# Altium project RAD.PrjPcb
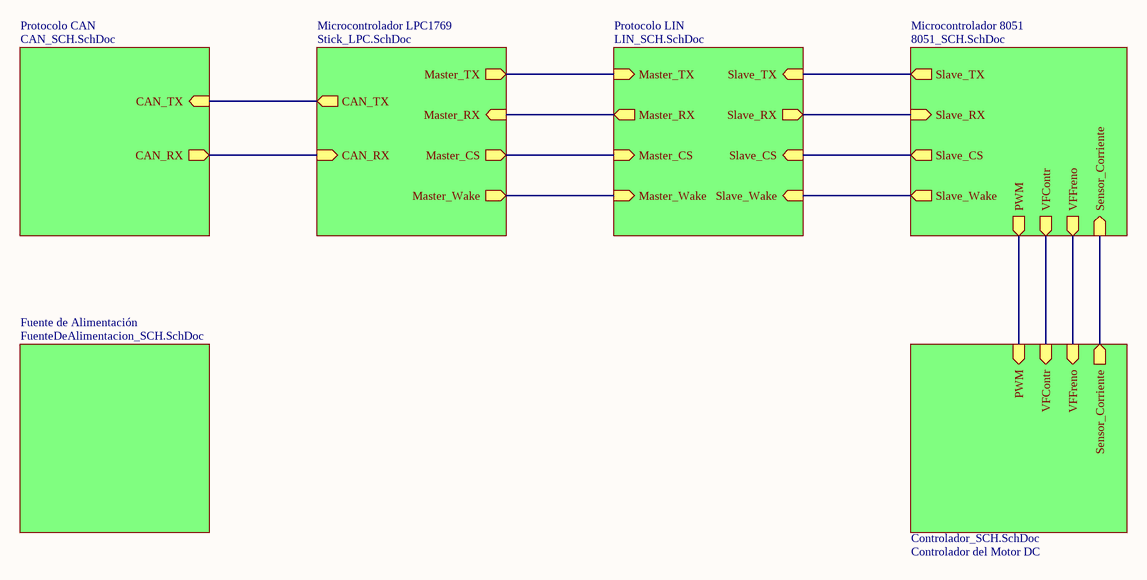
[diagram p0: TOP_SCH.SchDoc]
7 sheets, 87 parts. Net scope: hierarchical (ports join the sheet entries above them; power ports are global).
Board file: PCB_RAD.PcbDoc
Sheets:
  TOP_SCH.SchDoc
    Protocolo CAN = CAN_SCH.SchDoc
    Microcontrolador LPC1769 = Stick_LPC.SchDoc
    Protocolo LIN = LIN_SCH.SchDoc
    Microcontrolador 8051 = 8051_SCH.SchDoc
    Controlador del Motor DC = Controlador_SCH.SchDoc
    Fuente de Alimentación = FuenteDeAlimentacion_SCH.SchDoc

## Sheet TOP_SCH.SchDoc: Top Connections
size A4; Author: **; CompanyName: Electrónica Aplicada al Automotor; Organization: UTN FRBA; DocumentNumber: 1; Revision: 00; SheetNumber: 1; SheetTotal: 7; Autor: Badenas, Francisco J. / Ipar, Eugenia

### Sub-sheets
Controlador del Motor DC = Controlador_SCH.SchDoc: Sensor_Corriente (out), VFFreno (in), VFContr (in), PWM (in)
Fuente de Alimentación = FuenteDeAlimentacion_SCH.SchDoc: no entries
Microcontrolador 8051 = 8051_SCH.SchDoc: Slave_TX (out), Slave_RX (in), Slave_CS (out), Slave_Wake (out), PWM (out), VFContr (out), VFFreno (out), Sensor_Corriente (in)
Microcontrolador LPC1769 = Stick_LPC.SchDoc: CAN_TX (out), CAN_RX (in), Master_TX (out), Master_RX (in), Master_CS (out), Master_Wake (out)
Protocolo CAN = CAN_SCH.SchDoc: CAN_TX (in), CAN_RX (out)
Protocolo LIN = LIN_SCH.SchDoc: Master_TX (in), Master_RX (out), Master_CS (in), Master_Wake (in), Slave_TX (in), Slave_RX (out), Slave_CS (in), Slave_Wake (in)

### Nets
LPC_CAN_RX: sheet Protocolo CAN/CAN_RX, sheet Microcontrolador LPC1769/CAN_RX
LPC_CAN_TX: sheet Protocolo CAN/CAN_TX, sheet Microcontrolador LPC1769/CAN_TX
LPC_CS: sheet Microcontrolador LPC1769/Master_CS, sheet Protocolo LIN/Master_CS
LPC_RX: sheet Microcontrolador LPC1769/Master_RX, sheet Protocolo LIN/Master_RX
LPC_TX: sheet Microcontrolador LPC1769/Master_TX, sheet Protocolo LIN/Master_TX
LPC_W: sheet Microcontrolador LPC1769/Master_Wake, sheet Protocolo LIN/Master_Wake
PWM: sheet Microcontrolador 8051/PWM, sheet Controlador del Motor DC/PWM
Slave_CS: sheet Protocolo LIN/Slave_CS, sheet Microcontrolador 8051/Slave_CS
Slave_RX: sheet Protocolo LIN/Slave_RX, sheet Microcontrolador 8051/Slave_RX
Slave_TX: sheet Protocolo LIN/Slave_TX, sheet Microcontrolador 8051/Slave_TX
Slave_Wake: sheet Protocolo LIN/Slave_Wake, sheet Microcontrolador 8051/Slave_Wake
VFContr: sheet Microcontrolador 8051/VFContr, sheet Controlador del Motor DC/VFContr
VFFreno: sheet Microcontrolador 8051/VFFreno, sheet Controlador del Motor DC/VFFreno
NetC3_1: sheet Microcontrolador 8051/Sensor_Corriente, sheet Controlador del Motor DC/Sensor_Corriente

### Notes on the sheet
- Title:
- Size:
- Author:
- A4
- Sheet
- of
- Revision:
- File:
- Date:

## Sheet CAN_SCH.SchDoc: Transceiver CAN
size A4; Author: **; CompanyName: Electrónica Aplicada al Automotor; Organization: UTN FRBA; DocumentNumber: 6; Revision: 00; SheetNumber: 6; SheetTotal: 7; Autor: Badenas, Francisco J. / Ipar, Eugenia
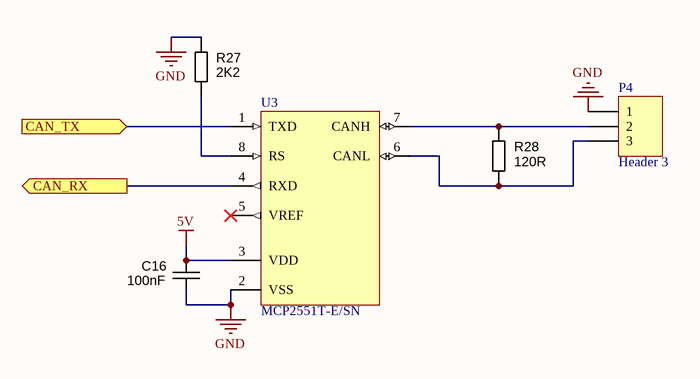
[diagram p1: CAN_SCH.SchDoc]

### Parts
C16  100nF  [CAPC1608X90N]
P4  Header 3  [HDR1X3]
R27  2K2  [RESC1608N_ZERO]
R28  120R  [RESC1608N_ZERO]
U3  MCP2551T-E/SN  [SOIC-SN8_M]

### Ports
CAN_RX (out), CAN_TX (in)

### Nets
5V: C16.1 U3.3(VDD)
GND: C16.2 P4.1 R27.1 U3.2(VSS)
LPC_CAN_RX: U3.4(RXD) ; port CAN_RX
LPC_CAN_TX: U3.1(TXD) ; port CAN_TX
NetP4_2: P4.2 R28.1 U3.7(CANH)
NetP4_3: P4.3 R28.2 U3.6(CANL)
NetR27_2: R27.2 U3.8(RS)

Not connected (* = marked no-connect by the designer): U3 5(VREF)*

### Notes on the sheet
- Title:
- Size:
- Author:
- A4
- Sheet
- of
- Revision:
- File:
- Date:

### Library data of the parts
C16 = CAPC_47n_0603_X7R_50V_10%: Capacitor SMD Cer 100nF 10% 50V X7R 0603; Manufacturer 1: AVX Corporation; Manufacturer Part Number 1: 06035C473KAT2A; Ratings: 50V; X7R; Material: ceramic; SCDType: spec; Manufacturer 3: Samsung; Manufacturer Part Number 3: CL10B473KBN; Package / Case: 0603 (1608 metric); Tolerance: ±10%; Supplier 1: Digi-Key; Supplier Part Number 1: 478-5146-1-ND; Manufacturer Part Number 2: C1608X7R1H473K080AA; Manufacturer 2: TDK Corporation; ComponentLink1URL: http://www.avx.com/docs/Catalogs/cx7r.pdf; ComponentLink1Description: http://www.avx.com/docs/Catalogs/cx7r.pdf; Supplier 2: Digi-Key; Supplier Part Number 2: 445-1313-1-ND; ComponentLink2URL: http://product.tdk.com/capacitor/mlcc/en/documents/mlcc_commercial_general_en.pdf; ComponentLink2Description: http://product.tdk.com/capacitor/mlcc/en/documents/mlcc_commercial_general_en.pdf; Value: 100nF
P4 = Header 3: Header, 3-Pin; LatestRevisionDate: 17-Jul-2002; LatestRevisionNote: Re-released for DXP Platform.; Publisher: Altium Limited
R27 = RES_0R_0603: Resistor SMD 0603 2.2K 5%; Manufacturer 1: Vishay/Dale; Manufacturer Part Number 1: CRCW06030000Z0EA; Ratings: 1/10W; SCDType: spec; Tolerance: ±5%; Package / Case: 0603 (1608metric); Supplier 1: Digi-Key; Supplier Part Number 1: 541-0.0GCT-ND; ComponentLink1URL: http://www.vishay.com/doc?20035; ComponentLink1Description: http://www.vishay.com/doc?20035; Supplier 2: Digi-Key; Supplier Part Number 2: P0.0GTR-ND; Manufacturer 2: Panasonic Electronic Components; Manufacturer Part Number 2: ERJ-3GEY0R00V; RoHS 2: RoHS Compliant; ComponentLink2URL: http://industrial.panasonic.com/www-cgi/jvcr13pz.cgi?E+PZ+3+AOA0001+ERJ3GEY0R00V+7+WW; ComponentLink2Description: http://industrial.panasonic.com/www-cgi/jvcr13pz.cgi?E+PZ+3+AOA0001+ERJ3GEY0R00V+7+WW; Supplier 3: Digi-Key; Supplier Part Number 3: 311-0.0LECT-ND; Manufacturer 3: Yageo; Manufacturer Part Number 3: AC0603JR-070RL; RoHS 3: RoHS Compliant; ComponentLink3URL: http://www.yageo.com/documents/recent/PYu-AC_51_RoHS_L_2.pdf; ComponentLink3Description: http://www.yageo.com/documents/recent/PYu-AC_51_RoHS_L_2.pdf; Value: 2K2
R28 = RES_0R_0603: Resistor SMD 0603 120 Ohm 5%; Manufacturer 1: Vishay/Dale; Manufacturer Part Number 1: CRCW06030000Z0EA; Ratings: 1/10W; SCDType: spec; Tolerance: ±5%; Package / Case: 0603 (1608metric); Supplier 1: Digi-Key; Supplier Part Number 1: 541-0.0GCT-ND; ComponentLink1URL: http://www.vishay.com/doc?20035; ComponentLink1Description: http://www.vishay.com/doc?20035; Supplier 2: Digi-Key; Supplier Part Number 2: P0.0GTR-ND; Manufacturer 2: Panasonic Electronic Components; Manufacturer Part Number 2: ERJ-3GEY0R00V; RoHS 2: RoHS Compliant; ComponentLink2URL: http://industrial.panasonic.com/www-cgi/jvcr13pz.cgi?E+PZ+3+AOA0001+ERJ3GEY0R00V+7+WW; ComponentLink2Description: http://industrial.panasonic.com/www-cgi/jvcr13pz.cgi?E+PZ+3+AOA0001+ERJ3GEY0R00V+7+WW; Supplier 3: Digi-Key; Supplier Part Number 3: 311-0.0LECT-ND; Manufacturer 3: Yageo; Manufacturer Part Number 3: AC0603JR-070RL; RoHS 3: RoHS Compliant; ComponentLink3URL: http://www.yageo.com/documents/recent/PYu-AC_51_RoHS_L_2.pdf; ComponentLink3Description: http://www.yageo.com/documents/recent/PYu-AC_51_RoHS_L_2.pdf; Value: 120R
U3 = CMP-0186-00036-2: High-Speed CAN Transceiver, 8-Pin SOIC, Extended Temperature, Tape and Reel; PackageReference: SOIC-SN8; PackageDescription: 8-Lead Plastic Small Outline (SN) - Narrow, 3.90mm Body [SOIC]; RevisionNote: URLs added. DatasheetVersion updated.; ComponentLink2Description: Datasheet; ComponentLink1Description: Manufacturer URL; ComponentLink3Description: Package Specification; PackageVersion: revBB, Aug-2009; DatasheetVersion: revF, Jul-2010; Code_JEDEC: MS-012; ComponentLink1URL: http://www.microchip.com/; Code_IPC: SOIC127P600-8; ComponentLink2URL: http://ww1.microchip.com/downloads/en/DeviceDoc/21667F.pdf; ComponentLink3URL: http://www.microchip.com/stellent/groups/techpub_sg/documents/packagingspec/en012702.pdf

## Sheet Stick_LPC.SchDoc: Microcontrolador LPC1769
size A4; Author: **; CompanyName: Electrónica Aplicada al Automotor; Organization: UTN FRBA; DocumentNumber: 3; Revision: 00; SheetNumber: 3; SheetTotal: 7; Autor: Badenas, Francisco J. / Ipar, Eugenia
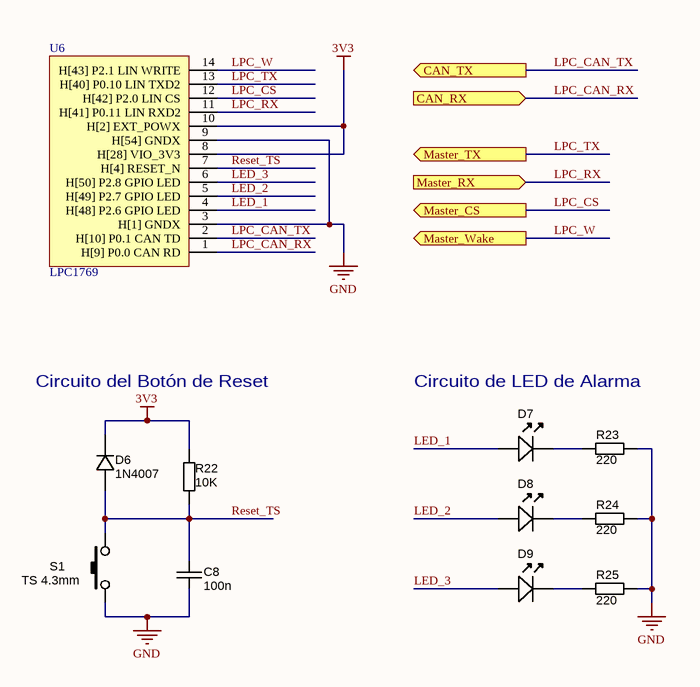
[diagram p2: Stick_LPC.SchDoc]

### Parts
C8  100n  [CAPC1608X90N]
D6  1N4007  [DO-214AC]
D7  Green  [LED-0603-GREEN]  (value not drawn)
D8  Green  [LED-0603-GREEN]  (value not drawn)
D9  Green  [LED-0603-GREEN]  (value not drawn)
R22  10K  [RESC1608N_ZERO]
R23  220  [RESC1608N_ZERO]
R24  220  [RESC1608N_ZERO]
R25  220  [RESC1608N_ZERO]
S1  Manufacturer Part Number 1: TS 4.3mm  [TACT-SWITCH-TS1143]  (hidden comment: SW_THT_PB_4.3mm)
U6  LPC1769  [Header_12]

### Ports
CAN_RX (in), CAN_TX (out), Master_CS (out), Master_RX (in), Master_TX (out), Master_Wake (out)

### Nets
3V3: D6.K R22.1 U6.8(H[28]_VIO_3V3) U6.10(H[2]_EXT_POWX)
GND: C8.2 R23.2 R24.2 R25.2 S1.1 U6.3(H[1]_GNDX) U6.9(H[54]_GNDX)
LED_1: D7.A U6.4(H[48]_P2.6_GPIO_LED)
LED_2: D8.A U6.5(H[49]_P2.7_GPIO_LED)
LED_3: D9.A U6.6(H[50]_P2.8_GPIO_LED)
LPC_CAN_RX: U6.1(H[9]_P0.0_CAN_RD) ; port CAN_RX
LPC_CAN_TX: U6.2(H[10]_P0.1_CAN_TD) ; port CAN_TX
LPC_CS: U6.12(H[42]_P2.0_LIN_CS) ; port Master_CS
LPC_RX: U6.11(H[41]_P0.11_LIN_RXD2) ; port Master_RX
LPC_TX: U6.13(H[40]_P0.10_LIN_TXD2) ; port Master_TX
LPC_W: U6.14(H[43]_P2.1_LIN_WRITE) ; port Master_Wake
Reset_TS: C8.1 D6.A R22.2 S1.2 U6.7(H[4]_RESET_N)
NetD7_K: D7.K R23.1
NetD8_K: D8.K R24.1
NetD9_K: D9.K R25.1

### Notes on the sheet
- Circuito del Botón de Reset
- Circuito de LED de Alarma
- Title:
- Size:
- Author:
- A4
- Sheet
- of
- Revision:
- File:
- Date:

### Library data of the parts
C8 = CAPC_47n_0603_X7R_50V_10%: as C16 on sheet CAN_SCH; Manufacturer 3: Samsung; Manufacturer Part Number 3: CL10B473KBN; Package / Case: 0603 (1608 metric); Tolerance: ±10%; Supplier 1: Digi-Key; Supplier Part Number 1: 478-5146-1-ND; Manufacturer Part Number 2: C1608X7R1H473K080AA; Manufacturer 2: TDK Corporation; ComponentLink1URL: http://www.avx.com/docs/Catalogs/cx7r.pdf; ComponentLink1Description: http://www.avx.com/docs/Catalogs/cx7r.pdf; Supplier 2: Digi-Key; Supplier Part Number 2: 445-1313-1-ND; ComponentLink2URL: http://product.tdk.com/capacitor/mlcc/en/documents/mlcc_commercial_general_en.pdf; ComponentLink2Description: http://product.tdk.com/capacitor/mlcc/en/documents/mlcc_commercial_general_en.pdf; Value: 100n
D6 = DIODE_100V_1.5A_SMA: Diode 1N4007 SMD DO-214AC 100V 1.5A SMA; Manufacturer 1: Diodes Inc; Ratings: 100V; 1.5A; Material: Si; Diode Type: Standard; Value: Vf = 1.15V @ 1.5A (Max); SCDType: source; Package / Case: DO-214AC, SMA; Supplier 1: Digi-Key; Supplier Part Number 1: S2BA-FDICT-ND; Manufacturer Part Number 1: 1N4007
D7-D9 = LED_SMD_Green_0603_570nm: LED 0603 SMD Green 570nm 50mcd 20mA; Manufacturer 1: Kingbright Company LLC; Manufacturer Part Number 1: APT1608CGCK; Material: AlGaInP; Ratings: 20mcd min; 50 mcd typ; 570 nm; Voltage - Forward (Vf) Typ: 2.1V; Viewing Angle: 120°; Lens Style/Size: Rectangle with Flat Top, 1.1mm x 0.8mm; Voltage - Forward (Vf) @ 10mA: 2.0V; SCDType: source; Wavelength - Peak: 574nm; Lens Type: Clear; Package / Case: 0603 (1608 metric); Color: Green; Current - Test: 20mA; Supplier 1: Digi-Key; Supplier Part Number 1: 754-1116-1-ND; RoHS 1: RoHS Compliant; Wavelength - Dominant: 570nm; ComponentLink1URL: http://www.us.kingbright.com/images/catalog/SPEC/APT1608CGCK.pdf; ComponentLink1Description: http://www.us.kingbright.com/images/catalog/SPEC/APT1608CGCK.pdf
R22 = RES_0R_0603: Resistor SMD 0603 10K 5%; Manufacturer 1: Vishay/Dale; Manufacturer Part Number 1: CRCW06030000Z0EA; Ratings: 1/10W; SCDType: spec; Tolerance: ±5%; Package / Case: 0603 (1608metric); Supplier 1: Digi-Key; Supplier Part Number 1: 541-0.0GCT-ND; ComponentLink1URL: http://www.vishay.com/doc?20035; ComponentLink1Description: http://www.vishay.com/doc?20035; Supplier 2: Digi-Key; Supplier Part Number 2: P0.0GTR-ND; Manufacturer 2: Panasonic Electronic Components; Manufacturer Part Number 2: ERJ-3GEY0R00V; RoHS 2: RoHS Compliant; ComponentLink2URL: http://industrial.panasonic.com/www-cgi/jvcr13pz.cgi?E+PZ+3+AOA0001+ERJ3GEY0R00V+7+WW; ComponentLink2Description: http://industrial.panasonic.com/www-cgi/jvcr13pz.cgi?E+PZ+3+AOA0001+ERJ3GEY0R00V+7+WW; Supplier 3: Digi-Key; Supplier Part Number 3: 311-0.0LECT-ND; Manufacturer 3: Yageo; Manufacturer Part Number 3: AC0603JR-070RL; RoHS 3: RoHS Compliant; ComponentLink3URL: http://www.yageo.com/documents/recent/PYu-AC_51_RoHS_L_2.pdf; ComponentLink3Description: http://www.yageo.com/documents/recent/PYu-AC_51_RoHS_L_2.pdf; Value: 10K
R23-R25 = RES_0R_0603: Resistor SMD 0603 220 Ohm 5%; Manufacturer 1: Vishay/Dale; Manufacturer Part Number 1: CRCW06030000Z0EA; Ratings: 1/10W; SCDType: spec; Tolerance: ±5%; Package / Case: 0603 (1608metric); Supplier 1: Digi-Key; Supplier Part Number 1: 541-0.0GCT-ND; ComponentLink1URL: http://www.vishay.com/doc?20035; ComponentLink1Description: http://www.vishay.com/doc?20035; Supplier 2: Digi-Key; Supplier Part Number 2: P0.0GTR-ND; Manufacturer 2: Panasonic Electronic Components; Manufacturer Part Number 2: ERJ-3GEY0R00V; RoHS 2: RoHS Compliant; ComponentLink2URL: http://industrial.panasonic.com/www-cgi/jvcr13pz.cgi?E+PZ+3+AOA0001+ERJ3GEY0R00V+7+WW; ComponentLink2Description: http://industrial.panasonic.com/www-cgi/jvcr13pz.cgi?E+PZ+3+AOA0001+ERJ3GEY0R00V+7+WW; Supplier 3: Digi-Key; Supplier Part Number 3: 311-0.0LECT-ND; Manufacturer 3: Yageo; Manufacturer Part Number 3: AC0603JR-070RL; RoHS 3: RoHS Compliant; ComponentLink3URL: http://www.yageo.com/documents/recent/PYu-AC_51_RoHS_L_2.pdf; ComponentLink3Description: http://www.yageo.com/documents/recent/PYu-AC_51_RoHS_L_2.pdf; Value: 220
S1 = SW_THT_PB_4.3mm: Switch, tact, 4.3mm stem; Manufacturer 1: Bond-Tact; Function: Speed; SCDType: spec; Package / Case: 6.5x6.5mm; 4.3mm stem; Material: Brass/Nylon/Ag plating
U6 = LPC1769_Pinera: LPC1769 Pinera 5mm

## Sheet LIN_SCH.SchDoc: Transceiver LIN
size A4; Author: **; CompanyName: Electrónica Aplicada al Automotor; Organization: UTN FRBA; DocumentNumber: 7; Revision: 00; SheetNumber: 7; SheetTotal: 7; Autor: Badenas, Francisco J. / Ipar, Eugenia
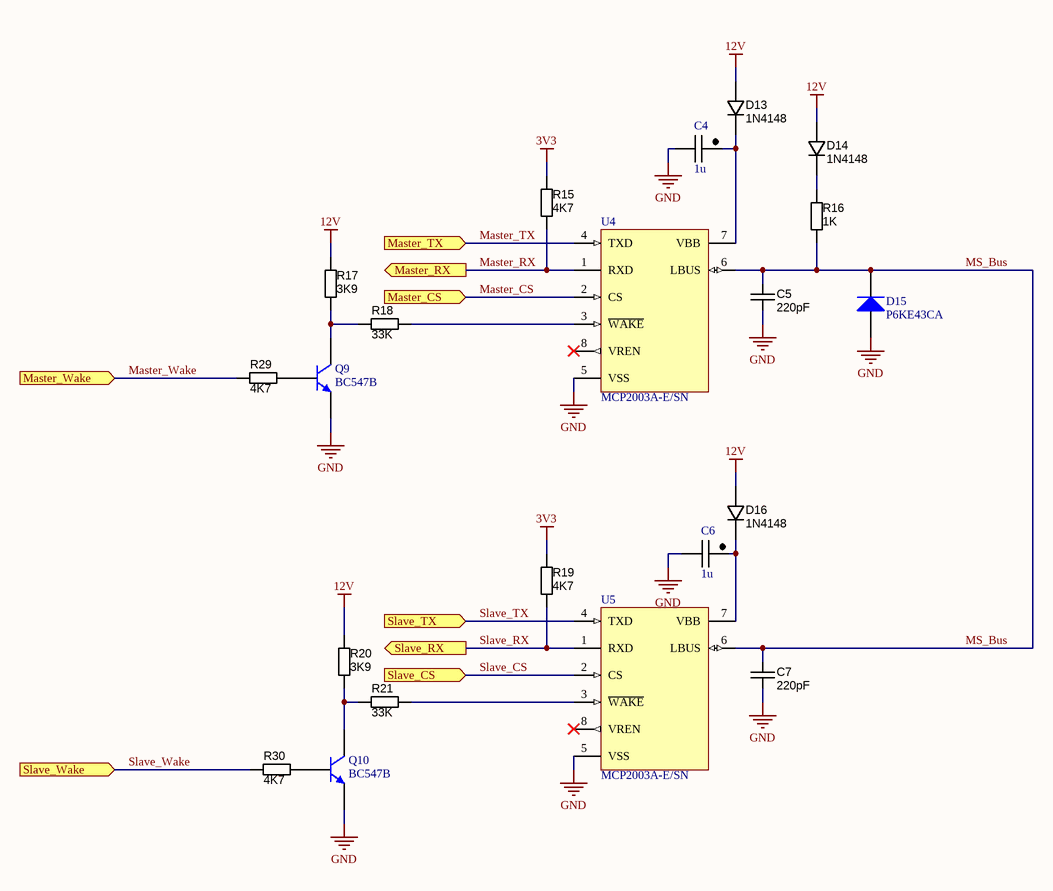
[diagram p3: LIN_SCH.SchDoc]

### Parts
C4  1u  [CAP_Elec_5x5.7]
C5  220pF  [CAPC1608X90N]
C6  1u  [CAP_Elec_5x5.7]
C7  220pF  [CAPC1608X90N]
D13  1N4148  [SOD523F]
D14  1N4148  [SOD523F]
D15  P6KE43CA  [DO-41]
D16  1N4148  [SOD523F]
Q9  BC547B  [TO-92A]
Q10  BC547B  [TO-92A]
R15  4K7  [RESC1608N_ZERO]
R16  1K  [RESC1608N_ZERO]
R17  3K9  [RESC1608N_ZERO]
R18  33K  [RESC1608N_ZERO]
R19  4K7  [RESC1608N_ZERO]
R20  3K9  [RESC1608N_ZERO]
R21  33K  [RESC1608N_ZERO]
R29  4K7  [RESC1608N_ZERO]
R30  4K7  [RESC1608N_ZERO]
U4  MCP2003A-E/SN  [SOIC-SN8_N]
U5  MCP2003A-E/SN  [SOIC-SN8_N]

### Ports
Master_CS (in), Master_RX (out), Master_TX (in), Master_Wake (in), Slave_CS (in), Slave_RX (out), Slave_TX (in), Slave_Wake (in)

### Nets
3V3: R15.1 R19.1
12V: D13.A D14.A D16.A R17.1 R20.1
GND: C4.2 C5.2 C6.2 C7.2 D15.1(A) Q9.1(E) Q10.1(E) U4.5(VSS) U5.5(VSS)
Master_CS: U4.2(CS) ; port Master_CS  [project net LPC_CS]
Master_RX: R15.2 U4.1(RXD) ; port Master_RX  [project net LPC_RX]
Master_TX: U4.4(TXD) ; port Master_TX  [project net LPC_TX]
Master_Wake: R29.1 ; port Master_Wake  [project net LPC_W]
MS_Bus: C5.1 C7.1 D15.2(K) R16.2 U4.6(LBUS) U5.6(LBUS)
Slave_CS: U5.2(CS) ; port Slave_CS
Slave_RX: R19.2 U5.1(RXD) ; port Slave_RX
Slave_TX: U5.4(TXD) ; port Slave_TX
Slave_Wake: R30.1 ; port Slave_Wake
NetC4_1: C4.1 D13.K U4.7(VBB)
NetC6_1: C6.1 D16.K U5.7(VBB)
NetD14_K: D14.K R16.1
NetQ9_2: Q9.2(B) R29.2
NetQ9_3: Q9.3(C) R17.2 R18.1
NetQ10_2: Q10.2(B) R30.2
NetQ10_3: Q10.3(C) R20.2 R21.1
NetR18_2: R18.2 U4.3(~{WAKE})
NetR21_2: R21.2 U5.3(~{WAKE})

Not connected (* = marked no-connect by the designer): U4 8(VREN)*; U5 8(VREN)*

### Notes on the sheet
- Title:
- Size:
- Author:
- A4
- Sheet
- of
- Revision:
- File:
- Date:

### Library data of the parts
C4 C6 = CAP_Elec_4x4
C5 C7 = CAPC_47n_0603_X7R_50V_10%: Capacitor SMD Cer 220pF 10% 50V X7R 0603; Manufacturer 1: AVX Corporation; Manufacturer Part Number 1: 06035C473KAT2A; Ratings: 50V; X7R; Material: ceramic; SCDType: spec; Manufacturer 3: Samsung; Manufacturer Part Number 3: CL10B473KBN; Package / Case: 0603 (1608 metric); Tolerance: ±10%; Supplier 1: Digi-Key; Supplier Part Number 1: 478-5146-1-ND; Manufacturer Part Number 2: C1608X7R1H473K080AA; Manufacturer 2: TDK Corporation; ComponentLink1URL: http://www.avx.com/docs/Catalogs/cx7r.pdf; ComponentLink1Description: http://www.avx.com/docs/Catalogs/cx7r.pdf; Supplier 2: Digi-Key; Supplier Part Number 2: 445-1313-1-ND; ComponentLink2URL: http://product.tdk.com/capacitor/mlcc/en/documents/mlcc_commercial_general_en.pdf; ComponentLink2Description: http://product.tdk.com/capacitor/mlcc/en/documents/mlcc_commercial_general_en.pdf; Value: 220pF
D13 D14 D16 = DIODE_1N4148_200mA_SOD523F: Diode 1N4148 SMD SOD-523F; Manufacturer 1: Fairchild Semiconductor; Manufacturer Part Number 1: 1N4148WT; Ratings: Vr=75V; Vf=1V@10mA; Io=200mA; Material: Si; SCDType: source; Package / Case: SC-79, SOD-523F; Supplier 1: Digi-Key; Supplier Part Number 1: 1N4148WTCT-ND; ComponentLink1URL: http://www.fairchildsemi.com/ds/1N/1N914BWT.pdf; ComponentLink1Description: http://www.fairchildsemi.com/ds/1N/1N914BWT.pdf; Value: 1N4148
D15 = Diode 1N4007: 1 Amp General Purpose Rectifier Do-41; Published: 8-Jun-2000; LatestRevisionDate: 17-Jul-2002; LatestRevisionNote: Re-released for DXP Platform.; DatasheetVersion: 1998; PackageVersion: Aug-1999; PackageReference: DO-41; Publisher: Altium Limited; PackageDescription: Diode, Axial; Body 5.2 x 2.7 mm (LxDia. max), Lead Dia. 0.86 mm (max); Code_JEDEC: DO-204-AL; ComponentLink1Description: Manufacturer Link; ComponentLink1URL: http://www.fairchildsemi.com/; ComponentLink2Description: Datasheet; ComponentLink2URL: http://www.fairchildsemi.com/ds/1N%2F1N4001.pdf
Q9 Q10 = 2N3904: NPN General Purpose Amplifier; Published: 8-Jun-2000; LatestRevisionDate: 15-Jan-2003; LatestRevisionNote: PCB Footprint 'BCY-W3/D4.7' replaced; DatasheetVersion: 1997; PackageVersion: Sep-1998; PackageReference: TO-92A; Publisher: Altium Limited; PackageDescription: TO, Flat Index; 3 In-Line, Axial Leads; Body Dia. 4.5mm; Leads 0.51 x 0.48 mm (max); ComponentLink1Description: Manufacturer Link; ComponentLink1URL: http://www.fairchildsemi.com/; ComponentLink2Description: Datasheet; ComponentLink2URL: http://www.fairchildsemi.com/ds/2N%2F2N3904.pdf
R15 R19 R29 R30 = RES_0R_0603: Resistor SMD 0603 4.7K 5%; Manufacturer 1: Vishay/Dale; Manufacturer Part Number 1: CRCW06030000Z0EA; Ratings: 1/10W; SCDType: spec; Tolerance: ±5%; Package / Case: 0603 (1608metric); Supplier 1: Digi-Key; Supplier Part Number 1: 541-0.0GCT-ND; ComponentLink1URL: http://www.vishay.com/doc?20035; ComponentLink1Description: http://www.vishay.com/doc?20035; Supplier 2: Digi-Key; Supplier Part Number 2: P0.0GTR-ND; Manufacturer 2: Panasonic Electronic Components; Manufacturer Part Number 2: ERJ-3GEY0R00V; RoHS 2: RoHS Compliant; ComponentLink2URL: http://industrial.panasonic.com/www-cgi/jvcr13pz.cgi?E+PZ+3+AOA0001+ERJ3GEY0R00V+7+WW; ComponentLink2Description: http://industrial.panasonic.com/www-cgi/jvcr13pz.cgi?E+PZ+3+AOA0001+ERJ3GEY0R00V+7+WW; Supplier 3: Digi-Key; Supplier Part Number 3: 311-0.0LECT-ND; Manufacturer 3: Yageo; Manufacturer Part Number 3: AC0603JR-070RL; RoHS 3: RoHS Compliant; ComponentLink3URL: http://www.yageo.com/documents/recent/PYu-AC_51_RoHS_L_2.pdf; ComponentLink3Description: http://www.yageo.com/documents/recent/PYu-AC_51_RoHS_L_2.pdf; Value: 4K7
R16 = RES_0R_0603: Resistor SMD 0603 1K 5%; Manufacturer 1: Vishay/Dale; Manufacturer Part Number 1: CRCW06030000Z0EA; Ratings: 1/10W; SCDType: spec; Tolerance: ±5%; Package / Case: 0603 (1608metric); Supplier 1: Digi-Key; Supplier Part Number 1: 541-0.0GCT-ND; ComponentLink1URL: http://www.vishay.com/doc?20035; ComponentLink1Description: http://www.vishay.com/doc?20035; Supplier 2: Digi-Key; Supplier Part Number 2: P0.0GTR-ND; Manufacturer 2: Panasonic Electronic Components; Manufacturer Part Number 2: ERJ-3GEY0R00V; RoHS 2: RoHS Compliant; ComponentLink2URL: http://industrial.panasonic.com/www-cgi/jvcr13pz.cgi?E+PZ+3+AOA0001+ERJ3GEY0R00V+7+WW; ComponentLink2Description: http://industrial.panasonic.com/www-cgi/jvcr13pz.cgi?E+PZ+3+AOA0001+ERJ3GEY0R00V+7+WW; Supplier 3: Digi-Key; Supplier Part Number 3: 311-0.0LECT-ND; Manufacturer 3: Yageo; Manufacturer Part Number 3: AC0603JR-070RL; RoHS 3: RoHS Compliant; ComponentLink3URL: http://www.yageo.com/documents/recent/PYu-AC_51_RoHS_L_2.pdf; ComponentLink3Description: http://www.yageo.com/documents/recent/PYu-AC_51_RoHS_L_2.pdf; Value: 1K
R17 R20 = RES_0R_0603: Resistor SMD 0603 3.9K 5%; Manufacturer 1: Vishay/Dale; Manufacturer Part Number 1: CRCW06030000Z0EA; Ratings: 1/10W; SCDType: spec; Tolerance: ±5%; Package / Case: 0603 (1608metric); Supplier 1: Digi-Key; Supplier Part Number 1: 541-0.0GCT-ND; ComponentLink1URL: http://www.vishay.com/doc?20035; ComponentLink1Description: http://www.vishay.com/doc?20035; Supplier 2: Digi-Key; Supplier Part Number 2: P0.0GTR-ND; Manufacturer 2: Panasonic Electronic Components; Manufacturer Part Number 2: ERJ-3GEY0R00V; RoHS 2: RoHS Compliant; ComponentLink2URL: http://industrial.panasonic.com/www-cgi/jvcr13pz.cgi?E+PZ+3+AOA0001+ERJ3GEY0R00V+7+WW; ComponentLink2Description: http://industrial.panasonic.com/www-cgi/jvcr13pz.cgi?E+PZ+3+AOA0001+ERJ3GEY0R00V+7+WW; Supplier 3: Digi-Key; Supplier Part Number 3: 311-0.0LECT-ND; Manufacturer 3: Yageo; Manufacturer Part Number 3: AC0603JR-070RL; RoHS 3: RoHS Compliant; ComponentLink3URL: http://www.yageo.com/documents/recent/PYu-AC_51_RoHS_L_2.pdf; ComponentLink3Description: http://www.yageo.com/documents/recent/PYu-AC_51_RoHS_L_2.pdf; Value: 3K9
R18 R21 = RES_0R_0603: Resistor SMD 0603 33K 5%; Manufacturer 1: Vishay/Dale; Manufacturer Part Number 1: CRCW06030000Z0EA; Ratings: 1/10W; SCDType: spec; Tolerance: ±5%; Package / Case: 0603 (1608metric); Supplier 1: Digi-Key; Supplier Part Number 1: 541-0.0GCT-ND; ComponentLink1URL: http://www.vishay.com/doc?20035; ComponentLink1Description: http://www.vishay.com/doc?20035; Supplier 2: Digi-Key; Supplier Part Number 2: P0.0GTR-ND; Manufacturer 2: Panasonic Electronic Components; Manufacturer Part Number 2: ERJ-3GEY0R00V; RoHS 2: RoHS Compliant; ComponentLink2URL: http://industrial.panasonic.com/www-cgi/jvcr13pz.cgi?E+PZ+3+AOA0001+ERJ3GEY0R00V+7+WW; ComponentLink2Description: http://industrial.panasonic.com/www-cgi/jvcr13pz.cgi?E+PZ+3+AOA0001+ERJ3GEY0R00V+7+WW; Supplier 3: Digi-Key; Supplier Part Number 3: 311-0.0LECT-ND; Manufacturer 3: Yageo; Manufacturer Part Number 3: AC0603JR-070RL; RoHS 3: RoHS Compliant; ComponentLink3URL: http://www.yageo.com/documents/recent/PYu-AC_51_RoHS_L_2.pdf; ComponentLink3Description: http://www.yageo.com/documents/recent/PYu-AC_51_RoHS_L_2.pdf; Value: 33K
U4 U5 = CMP-0186-00221-1: LIN J2602 Transceiver, 8-Pin SOIC, Extended Temperature; Code_IPC: SOIC127P600-8; ComponentLink1URL: http://www.microchip.com/; Code_JEDEC: MS-012; PackageReference: SOIC-SN8; ComponentLink1Description: Manufacturer URL; DatasheetVersion: revD, Dec-2011; PackageVersion: revBB, Aug-2009; ComponentLink3URL: http://www.microchip.com/stellent/groups/techpub_sg/documents/packagingspec/en012702.pdf; ComponentLink2Description: Datasheet; ComponentLink3Description: Package Specification; ComponentLink2URL: http://ww1.microchip.com/downloads/en/DeviceDoc/22230D.pdf; PackageDescription: 8-Lead Plastic Small Outline (SN) - Narrow, 3.90mm Body [SOIC]

## Sheet 8051_SCH.SchDoc: Microcontrolador 8051
size A4; Author: **; CompanyName: Electrónica Aplicada al Automotor; Organization: UTN FRBA; DocumentNumber: 4; Revision: 00; SheetNumber: 4; SheetTotal: 7; Autor: Badenas, Francisco J. / Ipar, Eugenia
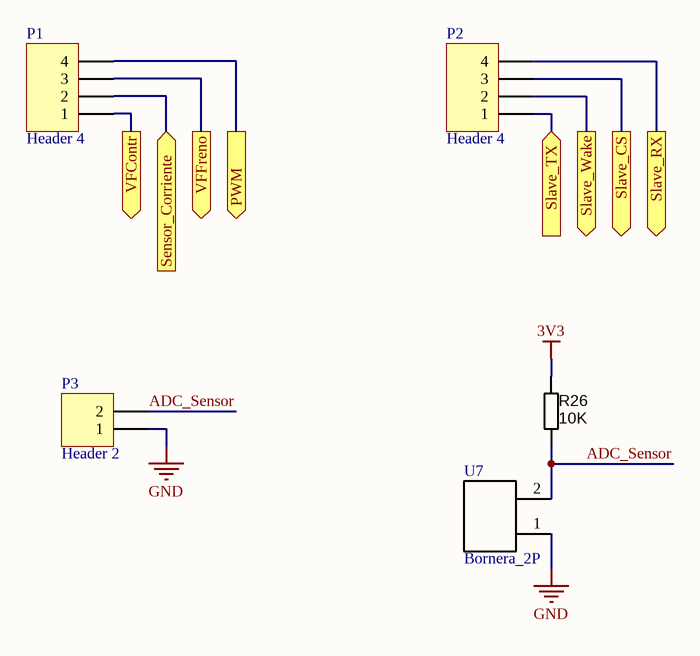
[diagram p4: 8051_SCH.SchDoc]

### Parts
P1  Header 4  [HDR1X4]
P2  Header 4  [HDR1X4]
P3  Header 2  [HDR1X2]
R26  10K  [RESC1608N_ZERO]
U7  Bornera_2P  [Bornera]

### Ports
PWM (out), Sensor_Corriente (in), Slave_CS (out), Slave_RX (out), Slave_TX (in), Slave_Wake (out), VFContr (out), VFFreno (out)

### Nets
3V3: R26.1
GND: P3.1 U7.1
ADC_Sensor: P3.2 R26.2 U7.2
PWM: P1.4 ; port PWM
Slave_CS: P2.3 ; port Slave_CS
Slave_RX: P2.4 ; port Slave_RX
Slave_TX: P2.1 ; port Slave_TX
Slave_Wake: P2.2 ; port Slave_Wake
VFContr: P1.1 ; port VFContr
VFFreno: P1.3 ; port VFFreno
NetC3_1: P1.2 ; port Sensor_Corriente

### Notes on the sheet
- Title:
- Size:
- Author:
- A4
- Sheet
- of
- Revision:
- File:
- Date:

### Library data of the parts
P1 P2 = Header 4: Header, 4-Pin; LatestRevisionDate: 17-Jul-2002; LatestRevisionNote: Re-released for DXP Platform.; Publisher: Altium Limited
P3 = Header 2: Header, 2-Pin; LatestRevisionDate: 17-Jul-2002; LatestRevisionNote: Re-released for DXP Platform.; Publisher: Altium Limited
R26 = RES_0R_0603: as R22 on sheet Stick_LPC; Tolerance: ±5%; Package / Case: 0603 (1608metric); Supplier 1: Digi-Key; Supplier Part Number 1: 541-0.0GCT-ND; ComponentLink1URL: http://www.vishay.com/doc?20035; ComponentLink1Description: http://www.vishay.com/doc?20035; Supplier 2: Digi-Key; Supplier Part Number 2: P0.0GTR-ND; Manufacturer 2: Panasonic Electronic Components; Manufacturer Part Number 2: ERJ-3GEY0R00V; RoHS 2: RoHS Compliant; ComponentLink2URL: http://industrial.panasonic.com/www-cgi/jvcr13pz.cgi?E+PZ+3+AOA0001+ERJ3GEY0R00V+7+WW; ComponentLink2Description: http://industrial.panasonic.com/www-cgi/jvcr13pz.cgi?E+PZ+3+AOA0001+ERJ3GEY0R00V+7+WW; Supplier 3: Digi-Key; Supplier Part Number 3: 311-0.0LECT-ND; Manufacturer 3: Yageo; Manufacturer Part Number 3: AC0603JR-070RL; RoHS 3: RoHS Compliant; ComponentLink3URL: http://www.yageo.com/documents/recent/PYu-AC_51_RoHS_L_2.pdf; ComponentLink3Description: http://www.yageo.com/documents/recent/PYu-AC_51_RoHS_L_2.pdf; Value: 10K

## Sheet Controlador_SCH.SchDoc: Controlador del motor Radiador
size A4; CompanyName: Electrónica Aplicada al Automotor; Organization: UTN FRBA; DocumentNumber: 5; Revision: 00; SheetNumber: 5; SheetTotal: 7; Autor: Badenas, Francisco J. / Ipar, Eugenia
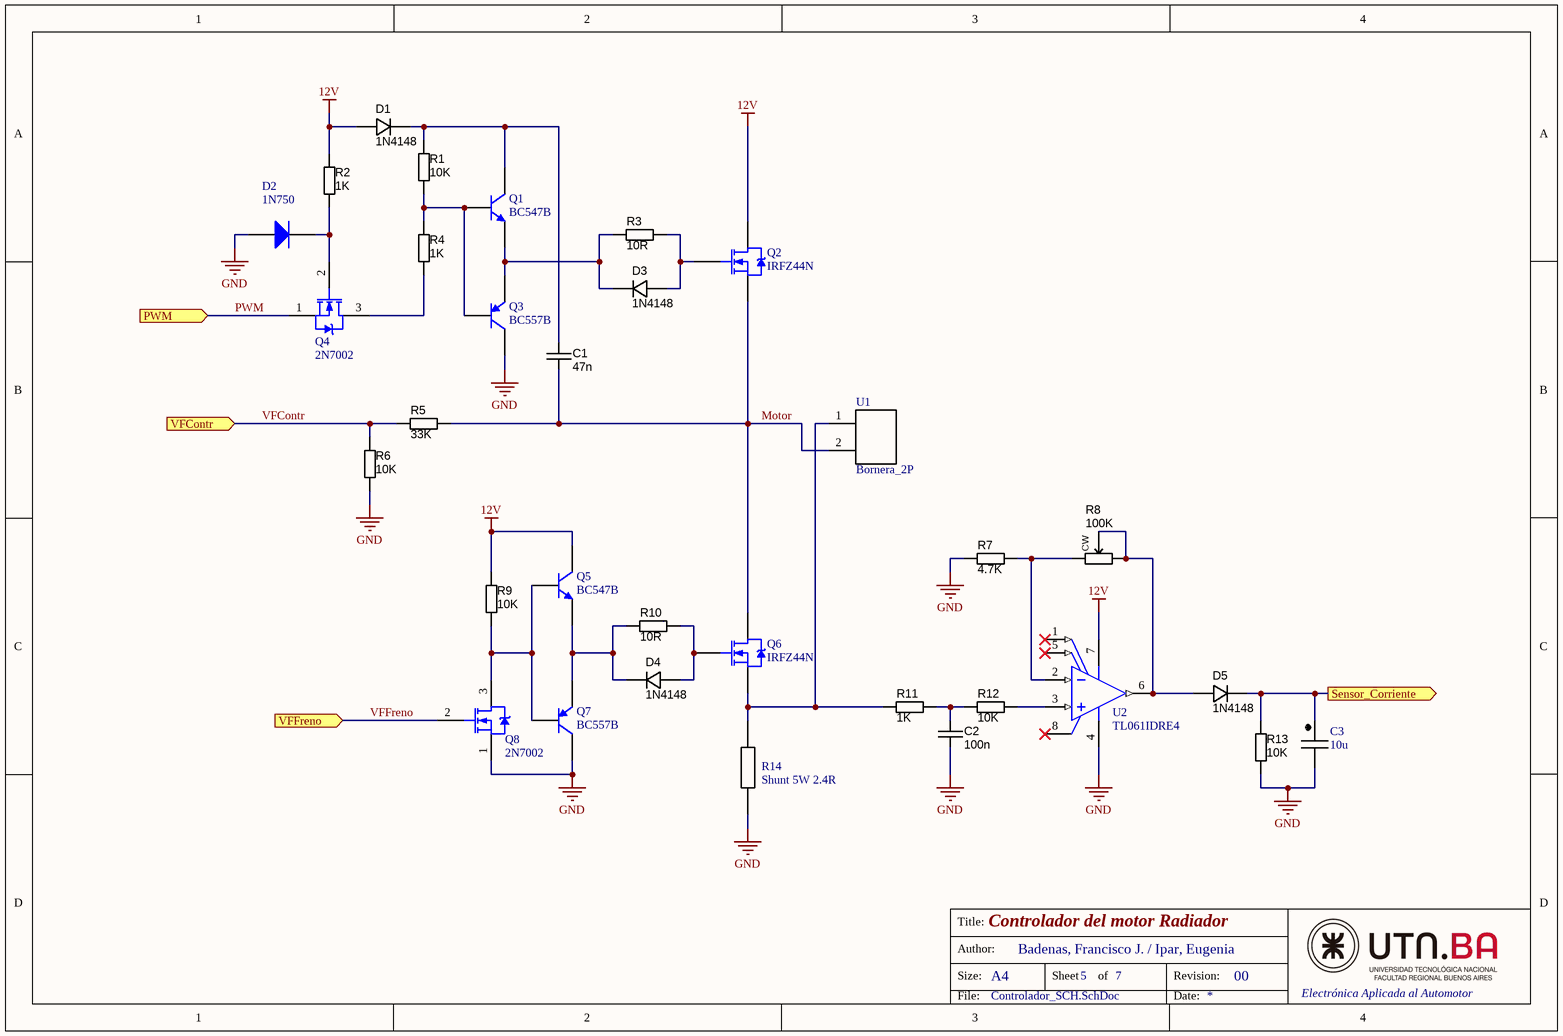
[diagram p5: Controlador_SCH.SchDoc]

### Parts
C1  47n  [CAPC1608X90N]
C2  100n  [CAPC1608X90N]
C3  10u  [CAP_Elec_5x5.7]
D1  1N4148  [SOD523F]
D2  1N750  [DO-35]
D3  1N4148  [SOD523F]
D4  1N4148  [SOD523F]
D5  1N4148  [SOD523F]
Q1  BC547B  [TO-92A]
Q2  IRFZ44N  [TO-220AB]
Q3  BC557B  [TO-92A]
Q4  2N7002  [ONSC-TO-92-3-29-11_AM_BL]
Q5  BC547B  [TO-92A]
Q6  IRFZ44N  [TO-220AB]
Q7  BC557B  [TO-92A]
Q8  2N7002  [ONSC-TO-92-3-29-11_AM_BL]
R1  10K  [RESC1608N_ZERO]
R2  1K  [RESC1608N_ZERO]
R3  10R  [RESC1608N_ZERO]
R4  1K  [RESC1608N_ZERO]
R5  33K  [RESC1608N_ZERO]
R6  10K  [RESC1608N_ZERO]
R7  4.7K  [RESC1608N_ZERO]
R8  value 100K  [TRIMPOT_THT_PV36X]  (hidden comment: Multivuelta 10K)
R9  10K  [RESC1608N_ZERO]
R10  10R  [RESC1608N_ZERO]
R11  1K  [RESC1608N_ZERO]
R12  10K  [RESC1608N_ZERO]
R13  10K  [RESC1608N_ZERO]
R14  Shunt 5W 2.4R  [Resistor]
U1  Bornera_2P  [Bornera]
U2  TL061IDRE4  [TI-D8_N]

### Ports
PWM (in), Sensor_Corriente (out), VFContr (in), VFFreno (in)

### Nets
12V: D1.A Q2.2(D) Q5.3(C) R2.1 R9.1 U2.7(VCC+)
GND: C2.2 C3.2 D2.1(A) Q3.3(C) Q7.3(C) Q8.1(S) R6.2 R7.1 R13.1 R14.1 U2.4(VCC-)
Motor: C1.2 Q2.3(S) Q6.2(D) R5.2 U1.2
PWM: Q4.1(S) ; port PWM
VFContr: R5.1 R6.1 ; port VFContr
VFFreno: Q8.2(G) ; port VFFreno
NetC1_1: C1.1 D1.K Q1.3(C) R1.1
NetC2_1: C2.1 R11.2 R12.1
NetC3_1: C3.1 D5.K R13.2 ; port Sensor_Corriente
NetD2_2: D2.2(K) Q4.2(G) R2.2
NetD3_A: D3.A Q2.1(G) R3.2
NetD3_K: D3.K Q1.1(E) Q3.1(E) R3.1
NetD4_A: D4.A Q6.1(G) R10.2
NetD4_K: D4.K Q5.1(E) Q7.1(E) R10.1
NetD5_A: D5.A R8.CCW R8.W U2.6(OUT)
NetQ1_2: Q1.2(B) Q3.2(B) R1.2 R4.1
NetQ4_3: Q4.3(D) R4.2
NetQ5_2: Q5.2(B) Q7.2(B) Q8.3(D) R9.2
NetQ6_3: Q6.3(S) R11.1 R14.2 U1.1
NetR7_2: R7.2 R8.CW U2.2(IN-)
NetR12_2: R12.2 U2.3(IN+)

Not connected (* = marked no-connect by the designer): U2 1(OFFSET_N1)* 5(OFFSET_N2)* 8(NC)*

### Notes on the sheet
- Title:
- Size:
- Author:
- A4
- Sheet
- of
- Revision:
- File:
- Date:

### Library data of the parts
C1 = CAPC_47n_0603_X7R_50V_10%: Capacitor SMD Cer 47nF 10% 50V X7R 0603; Manufacturer 1: AVX Corporation; Manufacturer Part Number 1: 06035C473KAT2A; Ratings: 50V; X7R; Material: ceramic; SCDType: spec; Manufacturer 3: Samsung; Manufacturer Part Number 3: CL10B473KBN; Package / Case: 0603 (1608 metric); Tolerance: ±10%; Supplier 1: Digi-Key; Supplier Part Number 1: 478-5146-1-ND; Manufacturer Part Number 2: C1608X7R1H473K080AA; Manufacturer 2: TDK Corporation; ComponentLink1URL: http://www.avx.com/docs/Catalogs/cx7r.pdf; ComponentLink1Description: http://www.avx.com/docs/Catalogs/cx7r.pdf; Supplier 2: Digi-Key; Supplier Part Number 2: 445-1313-1-ND; ComponentLink2URL: http://product.tdk.com/capacitor/mlcc/en/documents/mlcc_commercial_general_en.pdf; ComponentLink2Description: http://product.tdk.com/capacitor/mlcc/en/documents/mlcc_commercial_general_en.pdf; Value: 47n
C2 = CAPC_47n_0603_X7R_50V_10%: as C16 on sheet CAN_SCH; Manufacturer 3: Samsung; Manufacturer Part Number 3: CL10B473KBN; Package / Case: 0603 (1608 metric); Tolerance: ±10%; Supplier 1: Digi-Key; Supplier Part Number 1: 478-5146-1-ND; Manufacturer Part Number 2: C1608X7R1H473K080AA; Manufacturer 2: TDK Corporation; ComponentLink1URL: http://www.avx.com/docs/Catalogs/cx7r.pdf; ComponentLink1Description: http://www.avx.com/docs/Catalogs/cx7r.pdf; Supplier 2: Digi-Key; Supplier Part Number 2: 445-1313-1-ND; ComponentLink2URL: http://product.tdk.com/capacitor/mlcc/en/documents/mlcc_commercial_general_en.pdf; ComponentLink2Description: http://product.tdk.com/capacitor/mlcc/en/documents/mlcc_commercial_general_en.pdf; Value: 100n
C3 = CAP_Elec_4x4
D1 D3-D5 = DIODE_1N4148_200mA_SOD523F: as D13 on sheet LIN_SCH; Package / Case: SC-79, SOD-523F; Supplier 1: Digi-Key; Supplier Part Number 1: 1N4148WTCT-ND; ComponentLink1URL: http://www.fairchildsemi.com/ds/1N/1N914BWT.pdf; ComponentLink1Description: http://www.fairchildsemi.com/ds/1N/1N914BWT.pdf; Value: 1N4148
D2 = Diode 1N914: Diodo 1N750 THD DO-35; Published: 8-Jun-2000; LatestRevisionDate: 17-Jul-2002; LatestRevisionNote: Re-released for DXP Platform.; DatasheetVersion: 1997; PackageReference: DO-35; Publisher: Altium Limited; PackageDescription: Diode, Axial; Body 3.8 x 1.9 mm (LxDia. max), Lead Dia. 0.53 mm (max); Code_JEDEC: DO-204-AH; ComponentLink1Description: Manufacturer Link; ComponentLink1URL: http://www.fairchildsemi.com/; ComponentLink2Description: Datasheet; ComponentLink2URL: http://www.fairchildsemi.com/ds/1N%2F1N4448.pdf
Q1 Q5 = 2N3904: NPN General Purpose Amplifier; Published: 8-Jun-2000; LatestRevisionDate: 15-Jan-2003; LatestRevisionNote: PCB Footprint 'BCY-W3/D4.7' replaced; DatasheetVersion: 1997; PackageVersion: Sep-1998; PackageReference: TO-92A; Publisher: Altium Limited; PackageDescription: TO, Flat Index; 3 In-Line, Axial Leads; Body Dia. 4.5mm; Leads 0.51 x 0.48 mm (max); ComponentLink1Description: Manufacturer Link; ComponentLink1URL: http://www.fairchildsemi.com/; ComponentLink2Description: Datasheet; ComponentLink2URL: http://www.fairchildsemi.com/ds/2N%2F2N3904.pdf
Q2 Q6 = NMOS-2: N-Channel Power MOSFET; Note: Pin 2 is electrically connected to pin 4.; Published: 8-Jun-2000; LatestRevisionDate: 17-Jul-2002; LatestRevisionNote: Re-released for DXP Platform.; DatasheetVersion: PD-9.814; PackageVersion: Feb-1997; PackageReference: TO-220AB; Publisher: Altium Limited; PackageDescription: TO, Thru-Hole, Vertical, Heatsink Mounted; 3 In-Line Leads; Pitch 2.54 mm; ComponentLink1Description: Manufacturer Link; ComponentLink1URL: http://www.irf.com/
Q3 Q7 = 2N3906: PNP General Purpose Amplifier; Published: 8-Jun-2000; LatestRevisionDate: 15-Jan-2003; LatestRevisionNote: PCB Footprint 'BCY-W3/D4.7' replaced; DatasheetVersion: 1997; PackageVersion: Sep-1998; PackageReference: TO-92A; Publisher: Altium Limited; PackageDescription: TO, Flat Index; 3 In-Line, Axial Leads; Body Dia. 4.5mm; Leads 0.51 x 0.48 mm (max); ComponentLink1Description: Manufacturer Link; ComponentLink1URL: http://www.fairchildsemi.com/; ComponentLink2Description: Datasheet; ComponentLink2URL: http://www.fairchildsemi.com/ds/2N%2F2N3906.pdf
Q4 Q8 = CMP-1058-00948-1: Small Signal MOSFET, 200 mA, 60 V, N-Channel, 3-Pin TO-92, Pb-Free, Fan-Fold; PartNumber: 2N7000RLRPG; Manufacturer: On Semiconductor; V(BR)DSS Min (V): 60; VGS(th) Max (V): 3; ID Max (A): 0.2; Crss Typ (pF): 5; PD Max (W): 0.35; VGS Max (V): 20; Coss Typ (pF): 25; Channel Polarity: N Channel; Configuration: Single; PackageDescription: 3-Pin Transistor Outline, Body 4.825 x 3.685 mm, Pitch 1.27 mm; ComponentLink3URL: http://www.onsemi.com/pub_link/Collateral/MAC97-D.PDF; ComponentLink2URL: http://www.onsemi.com/pub_link/Collateral/2N7000-D.PDF; ComponentLink2Description: Datasheet; ComponentLink1Description: Manufacturer URL; DatasheetVersion: Rev. 8; RoHS: Pb-Free; Package Type: TO-92; PackageVersion: Rev. AM; ComponentLink3Description: Package Specification; ComponentLink1URL: http://www.onsemi.com/; Ciss Typ (pF): 60; Packing: Fan-Fold; PackageReference: TO-92-3-29-11_AM_BL; Mounting Technology: Through Hole
R1 R6 R9 R12 R13 = RES_0R_0603: as R22 on sheet Stick_LPC; Tolerance: ±5%; Package / Case: 0603 (1608metric); Supplier 1: Digi-Key; Supplier Part Number 1: 541-0.0GCT-ND; ComponentLink1URL: http://www.vishay.com/doc?20035; ComponentLink1Description: http://www.vishay.com/doc?20035; Supplier 2: Digi-Key; Supplier Part Number 2: P0.0GTR-ND; Manufacturer 2: Panasonic Electronic Components; Manufacturer Part Number 2: ERJ-3GEY0R00V; RoHS 2: RoHS Compliant; ComponentLink2URL: http://industrial.panasonic.com/www-cgi/jvcr13pz.cgi?E+PZ+3+AOA0001+ERJ3GEY0R00V+7+WW; ComponentLink2Description: http://industrial.panasonic.com/www-cgi/jvcr13pz.cgi?E+PZ+3+AOA0001+ERJ3GEY0R00V+7+WW; Supplier 3: Digi-Key; Supplier Part Number 3: 311-0.0LECT-ND; Manufacturer 3: Yageo; Manufacturer Part Number 3: AC0603JR-070RL; RoHS 3: RoHS Compliant; ComponentLink3URL: http://www.yageo.com/documents/recent/PYu-AC_51_RoHS_L_2.pdf; ComponentLink3Description: http://www.yageo.com/documents/recent/PYu-AC_51_RoHS_L_2.pdf; Value: 10K
R2 R4 R11 = RES_0R_0603: as R16 on sheet LIN_SCH; Tolerance: ±5%; Package / Case: 0603 (1608metric); Supplier 1: Digi-Key; Supplier Part Number 1: 541-0.0GCT-ND; ComponentLink1URL: http://www.vishay.com/doc?20035; ComponentLink1Description: http://www.vishay.com/doc?20035; Supplier 2: Digi-Key; Supplier Part Number 2: P0.0GTR-ND; Manufacturer 2: Panasonic Electronic Components; Manufacturer Part Number 2: ERJ-3GEY0R00V; RoHS 2: RoHS Compliant; ComponentLink2URL: http://industrial.panasonic.com/www-cgi/jvcr13pz.cgi?E+PZ+3+AOA0001+ERJ3GEY0R00V+7+WW; ComponentLink2Description: http://industrial.panasonic.com/www-cgi/jvcr13pz.cgi?E+PZ+3+AOA0001+ERJ3GEY0R00V+7+WW; Supplier 3: Digi-Key; Supplier Part Number 3: 311-0.0LECT-ND; Manufacturer 3: Yageo; Manufacturer Part Number 3: AC0603JR-070RL; RoHS 3: RoHS Compliant; ComponentLink3URL: http://www.yageo.com/documents/recent/PYu-AC_51_RoHS_L_2.pdf; ComponentLink3Description: http://www.yageo.com/documents/recent/PYu-AC_51_RoHS_L_2.pdf; Value: 1K
R3 R10 = RES_0R_0603: Resistor SMD 0603 10 Ohm 5%; Manufacturer 1: Vishay/Dale; Manufacturer Part Number 1: CRCW06030000Z0EA; Ratings: 1/10W; SCDType: spec; Tolerance: ±5%; Package / Case: 0603 (1608metric); Supplier 1: Digi-Key; Supplier Part Number 1: 541-0.0GCT-ND; ComponentLink1URL: http://www.vishay.com/doc?20035; ComponentLink1Description: http://www.vishay.com/doc?20035; Supplier 2: Digi-Key; Supplier Part Number 2: P0.0GTR-ND; Manufacturer 2: Panasonic Electronic Components; Manufacturer Part Number 2: ERJ-3GEY0R00V; RoHS 2: RoHS Compliant; ComponentLink2URL: http://industrial.panasonic.com/www-cgi/jvcr13pz.cgi?E+PZ+3+AOA0001+ERJ3GEY0R00V+7+WW; ComponentLink2Description: http://industrial.panasonic.com/www-cgi/jvcr13pz.cgi?E+PZ+3+AOA0001+ERJ3GEY0R00V+7+WW; Supplier 3: Digi-Key; Supplier Part Number 3: 311-0.0LECT-ND; Manufacturer 3: Yageo; Manufacturer Part Number 3: AC0603JR-070RL; RoHS 3: RoHS Compliant; ComponentLink3URL: http://www.yageo.com/documents/recent/PYu-AC_51_RoHS_L_2.pdf; ComponentLink3Description: http://www.yageo.com/documents/recent/PYu-AC_51_RoHS_L_2.pdf; Value: 10R
R5 = RES_0R_0603: as R18 on sheet LIN_SCH; Tolerance: ±5%; Package / Case: 0603 (1608metric); Supplier 1: Digi-Key; Supplier Part Number 1: 541-0.0GCT-ND; ComponentLink1URL: http://www.vishay.com/doc?20035; ComponentLink1Description: http://www.vishay.com/doc?20035; Supplier 2: Digi-Key; Supplier Part Number 2: P0.0GTR-ND; Manufacturer 2: Panasonic Electronic Components; Manufacturer Part Number 2: ERJ-3GEY0R00V; RoHS 2: RoHS Compliant; ComponentLink2URL: http://industrial.panasonic.com/www-cgi/jvcr13pz.cgi?E+PZ+3+AOA0001+ERJ3GEY0R00V+7+WW; ComponentLink2Description: http://industrial.panasonic.com/www-cgi/jvcr13pz.cgi?E+PZ+3+AOA0001+ERJ3GEY0R00V+7+WW; Supplier 3: Digi-Key; Supplier Part Number 3: 311-0.0LECT-ND; Manufacturer 3: Yageo; Manufacturer Part Number 3: AC0603JR-070RL; RoHS 3: RoHS Compliant; ComponentLink3URL: http://www.yageo.com/documents/recent/PYu-AC_51_RoHS_L_2.pdf; ComponentLink3Description: http://www.yageo.com/documents/recent/PYu-AC_51_RoHS_L_2.pdf; Value: 33K
R7 = RES_0R_0603: as R15 on sheet LIN_SCH; Tolerance: ±5%; Package / Case: 0603 (1608metric); Supplier 1: Digi-Key; Supplier Part Number 1: 541-0.0GCT-ND; ComponentLink1URL: http://www.vishay.com/doc?20035; ComponentLink1Description: http://www.vishay.com/doc?20035; Supplier 2: Digi-Key; Supplier Part Number 2: P0.0GTR-ND; Manufacturer 2: Panasonic Electronic Components; Manufacturer Part Number 2: ERJ-3GEY0R00V; RoHS 2: RoHS Compliant; ComponentLink2URL: http://industrial.panasonic.com/www-cgi/jvcr13pz.cgi?E+PZ+3+AOA0001+ERJ3GEY0R00V+7+WW; ComponentLink2Description: http://industrial.panasonic.com/www-cgi/jvcr13pz.cgi?E+PZ+3+AOA0001+ERJ3GEY0R00V+7+WW; Supplier 3: Digi-Key; Supplier Part Number 3: 311-0.0LECT-ND; Manufacturer 3: Yageo; Manufacturer Part Number 3: AC0603JR-070RL; RoHS 3: RoHS Compliant; ComponentLink3URL: http://www.yageo.com/documents/recent/PYu-AC_51_RoHS_L_2.pdf; ComponentLink3Description: http://www.yageo.com/documents/recent/PYu-AC_51_RoHS_L_2.pdf; Value: 4.7K
R8 = RES_TRIMMER_10K_25T_THT: Trimmer THD 10K 500mW 25-turn; Manufacturer 1: Murata Electronics North America; Manufacturer Part Number 1: PV36X103C01B00; Tolerance: ±10%; Ratings: 1/2W; ±100ppm/°C; SCDType: spec; Material: Cermet; Package / Case: 10.9mm L x 5.0mm W x 10.0mm H; Supplier 1: Digi-Key; Supplier Part Number 1: 490-2894-ND
R14 = Resistor 10W: Resistencia de Alambre 5W 2.4 Ohm
U2 = CMP-0017-00647-1: Low-Power JFET-Input General-Purpose Operational Amplifier, 7 to 36 V, -40 to 85 degC, 8-pin SOIC (D8), Green (RoHS & no Sb/Br); Manufacturer: Texas Instruments; Iq per channel(Max)(mA): 0.25; Rating: Military; Total Supply Voltage(Min)(+5V is 5, +/-5V is 10): 7; Number of Channels: 1; Vio (25C)(Max)(mV): 6; Slew Rate(Typ)(V/us): 3.5; Sub Family: General Purpose Amplifier, High Supply Voltage Amplifier (>=30V), Low Power Amp (<=500uA); Vn at 1kHz(Typ)(nV/rtHz): 42; IIB(Max)(pA): 200; CMRR(Min)(dB): 70; Total Supply Voltage(Max)(+5V is 5, +/-5V is 10): 36; Offset Drift(Typ)(uV/C): 10; Eco-Plan: Green (RoHS & no Sb/Br); ComponentLink1Description: Manufacturer URL; Code_JEDEC: MS-012; PackageVersion: 4040047-3/M, 06/2011; PackageReference: D8; ComponentLink3Description: Package Specification; ComponentLink1URL: http://www.ti.com/; ComponentLink2URL: http://www.ti.com/lit/ds/symlink/tl061.pdf; ComponentLink2Description: Datasheet; Mounting Technology: Surface Mount; ComponentLink3URL: http://www.ti.com/litv/pdf/msoi002j; GBW(Typ)(MHz): 1; PartNumber: TL061IDRE4; DatasheetVersion: SLOS078J; PackageDescription: 8-Pin Plastic Small Outline, Body 4.9 x 3.9 mm, Pitch 1.27 mm

## Sheet FuenteDeAlimentacion_SCH.SchDoc: Fuente de Alimentación
size A4; Author: **; CompanyName: Electrónica Aplicada al Automotor; Organization: UTN FRBA; DocumentNumber: 2; Revision: 01; SheetNumber: 2; SheetTotal: 7; Autor: Badenas, Francisco J. / Ipar, Eugenia
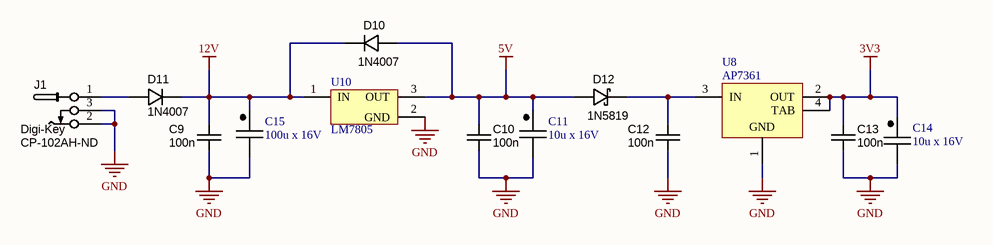
[diagram p6: FuenteDeAlimentacion_SCH.SchDoc]

### Parts
C9  100n  [CAPC1608X90N]
C10  100n  [CAPC1608X90N]
C11  10u x 16V  [CAP_Elec_5x5.7]
C12  100n  [CAPC1608X90N]
C13  100n  [CAPC1608X90N]
C14  10u x 16V  [CAP_Elec_5x5.7]
C15  100u x 16V  [CAP_ELEC_6.3X4.2]
D10  1N4007  [DO-214AC]
D11  1N4007  [DO-214AC]
D12  1N5819  [SOD123]
J1  Supplier 1: Digi-Key  Supplier Part Number 1: CP-102AH-ND  [CONN_PWR_JACK_2.1x5.5mm]  (hidden comment: CONN_PWR_JACK_2.1x5.5mm)
U8  AP7361  [MP04A_L]
U10  LM7805  [TO-220 FLAT]

### Nets
3V3: C13.1 C14.1 U8.2(OUT) U8.4(TAB)
5V: C10.1 C11.1 D10.A D12.A U10.3(OUT)
12V: C9.1 C15.1 D10.K D11.K U10.1(IN)
GND: C9.2 C10.2 C11.2 C12.2 C13.2 C14.2 C15.2 J1.2 J1.3 U8.1(GND) U10.2(GND)
NetC12_1: C12.1 D12.K U8.3(IN)
NetD11_A: D11.A J1.1

### Notes on the sheet
- Title:
- Size:
- Author:
- A4
- Sheet
- of
- Revision:
- File:
- Date:

### Library data of the parts
C9 C10 C12 C13 = CAPC_47n_0603_X7R_50V_10%: as C16 on sheet CAN_SCH; Manufacturer 3: Samsung; Manufacturer Part Number 3: CL10B473KBN; Package / Case: 0603 (1608 metric); Tolerance: ±10%; Supplier 1: Digi-Key; Supplier Part Number 1: 478-5146-1-ND; Manufacturer Part Number 2: C1608X7R1H473K080AA; Manufacturer 2: TDK Corporation; ComponentLink1URL: http://www.avx.com/docs/Catalogs/cx7r.pdf; ComponentLink1Description: http://www.avx.com/docs/Catalogs/cx7r.pdf; Supplier 2: Digi-Key; Supplier Part Number 2: 445-1313-1-ND; ComponentLink2URL: http://product.tdk.com/capacitor/mlcc/en/documents/mlcc_commercial_general_en.pdf; ComponentLink2Description: http://product.tdk.com/capacitor/mlcc/en/documents/mlcc_commercial_general_en.pdf; Value: 100n
C11 C14 = CAP_Elec_4x4
C15 = CAP_Elec_6.2x6.2
D10 D11 = DIODE_100V_1.5A_SMA: as D6 on sheet Stick_LPC; Package / Case: DO-214AC, SMA; Supplier 1: Digi-Key; Supplier Part Number 1: S2BA-FDICT-ND; Manufacturer Part Number 1: 1N4007
D12 = DIODE_SCHOTTKY_40V_1A: Diode Schottky SMD 40V 1A SOD123; Manufacturer 1: Diodes Inc; Ratings: 40V; 1A; Material: Si; SCDType: spec; Package / Case: SOD123; Diode Type: Schottky; Mounting Type: Surface Mount; Supplier 1: Digi-Key; Supplier Part Number 1: 1N5819HW-FDICT-ND; Manufacturer Part Number 1: 1N5819
J1 = CONN_PWR_JACK_2.1x5.5mm: Power Connector, THT, 2.1mm ID, 5.5mm OD; Manufacturer 1: CUI Inc; Manufacturer Part Number 1: PJ-102AH; SCDType: undef; Category: Connectors; Mounting Type: Through Hole; Package / Case: PCB mount; Value: 2.1mm ID, 5.5mm OD
U8 = CMP-0062-01652-3: 800mA Low-Dropout Linear Regulator, 4-pin SOT-223; Manufacturer: National Semiconductor; PartNumber: LM1117MPX-1.8; PackageTopMarking: XYTT*N12A; PowerWise: N; High-Reliability: Y; CompType: LDO IC; ComponentLink3URL: http://www.national.com/pf/LM/LM1117.html; RoHS: N; Code_JEDEC: TO-261-AA; ComponentLink1URL: http://www.national.com/; PinCount: 4; DatasheetVersion: Apr-2006; PackageReference: MP04A; RevisionNote: SCH symbol layout adjusted; ComponentLink2Description: LM1117 Datasheet; PackageDescription: Molded SOT-223, 6.50 x 3.56 x 1.6mm Body, 4 Lead, 2.3mm Pitch; ComponentLink2URL: http://www.national.com/ds/LM/LM1117.pdf; ComponentLink3Description: LM1117 Web Page; Code_IPC: SOT223-4; ComponentLink1Description: Manufacturer URL; ComponentLink4URL: http://www.national.com/packaging/folders/mp04a.html; PackageVersion: revB, Apr-2003; ComponentLink4Description: MP04A Package Page
U10 = LM7805: Regulador LM7805 Flat TO-220

## Nets that join several sheets
3V3: Stick_LPC (D6.K R22.1 U6.8 U6.10), LIN_SCH (R15.1 R19.1), 8051_SCH (R26.1), FuenteDeAlimentacion_SCH (C13.1 C14.1 U8.2 U8.4)
5V: CAN_SCH (C16.1 U3.3), FuenteDeAlimentacion_SCH (5 pins)
12V: LIN_SCH (5 pins), Controlador_SCH (6 pins), FuenteDeAlimentacion_SCH (5 pins)
GND: CAN_SCH (C16.2 P4.1 R27.1 U3.2), Stick_LPC (7 pins), LIN_SCH (9 pins), 8051_SCH (P3.1 U7.1), Controlador_SCH (11 pins), FuenteDeAlimentacion_SCH (11 pins)
LPC_CAN_RX: CAN_SCH (U3.4), Stick_LPC (U6.1)
LPC_CAN_TX: CAN_SCH (U3.1), Stick_LPC (U6.2)
LPC_CS: Stick_LPC (U6.12), LIN_SCH (U4.2)
LPC_RX: Stick_LPC (U6.11), LIN_SCH (R15.2 U4.1)
LPC_TX: Stick_LPC (U6.13), LIN_SCH (U4.4)
LPC_W: Stick_LPC (U6.14), LIN_SCH (R29.1)
NetC3_1: 8051_SCH (P1.2), Controlador_SCH (C3.1 D5.K R13.2)
PWM: 8051_SCH (P1.4), Controlador_SCH (Q4.1)
Slave_CS: LIN_SCH (U5.2), 8051_SCH (P2.3)
Slave_RX: LIN_SCH (R19.2 U5.1), 8051_SCH (P2.4)
Slave_TX: LIN_SCH (U5.4), 8051_SCH (P2.1)
Slave_Wake: LIN_SCH (R30.1), 8051_SCH (P2.2)
VFContr: 8051_SCH (P1.1), Controlador_SCH (R5.1 R6.1)
VFFreno: 8051_SCH (P1.3), Controlador_SCH (Q8.2)